# Altium project 英雄云台V1.施佳良.PrjPcb
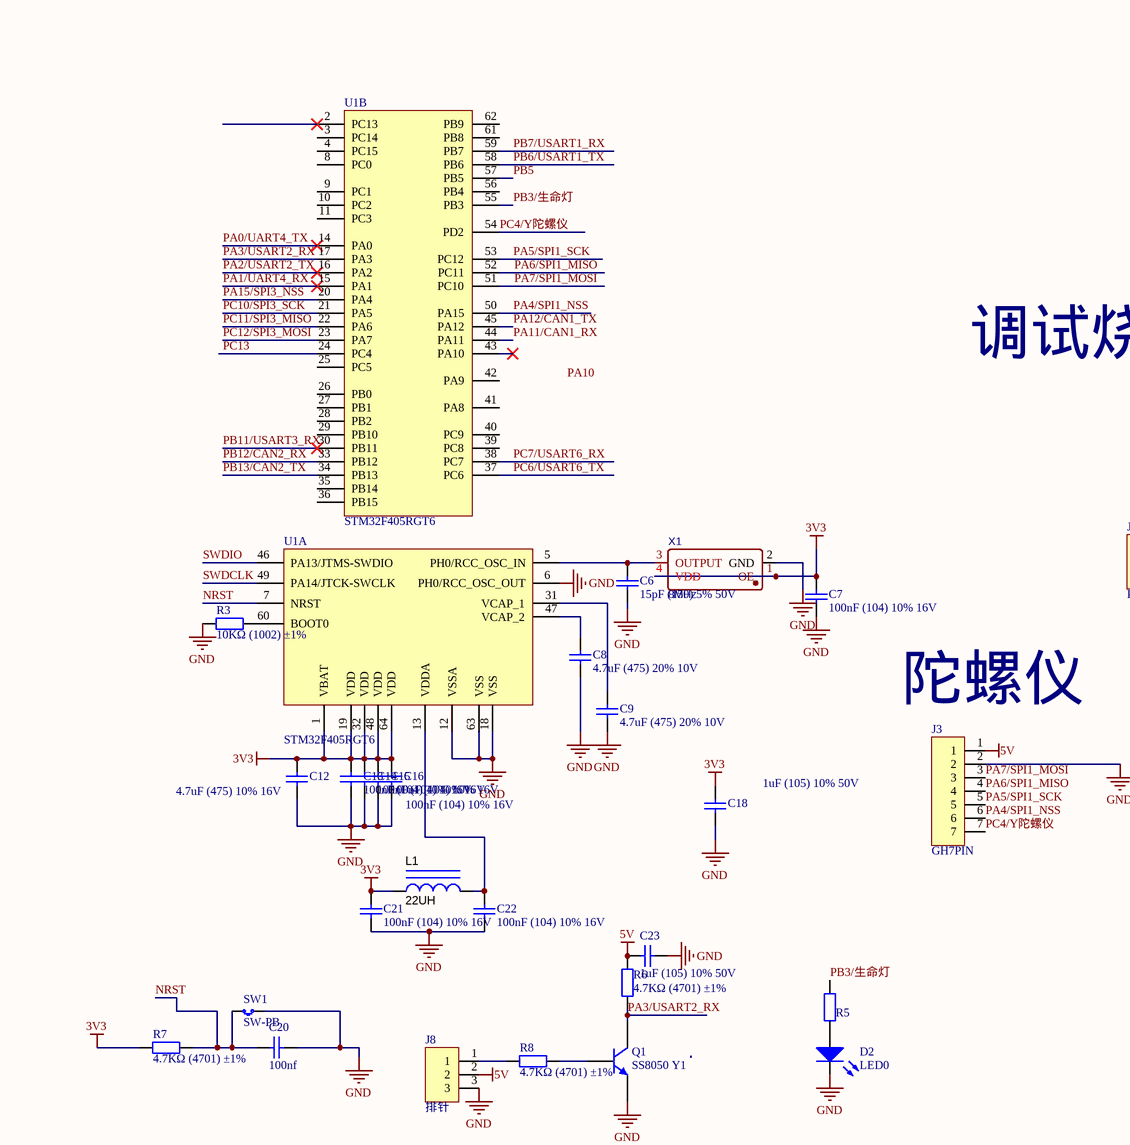
[diagram p0: 英雄云台V1.施佳良.SchDoc, top left]
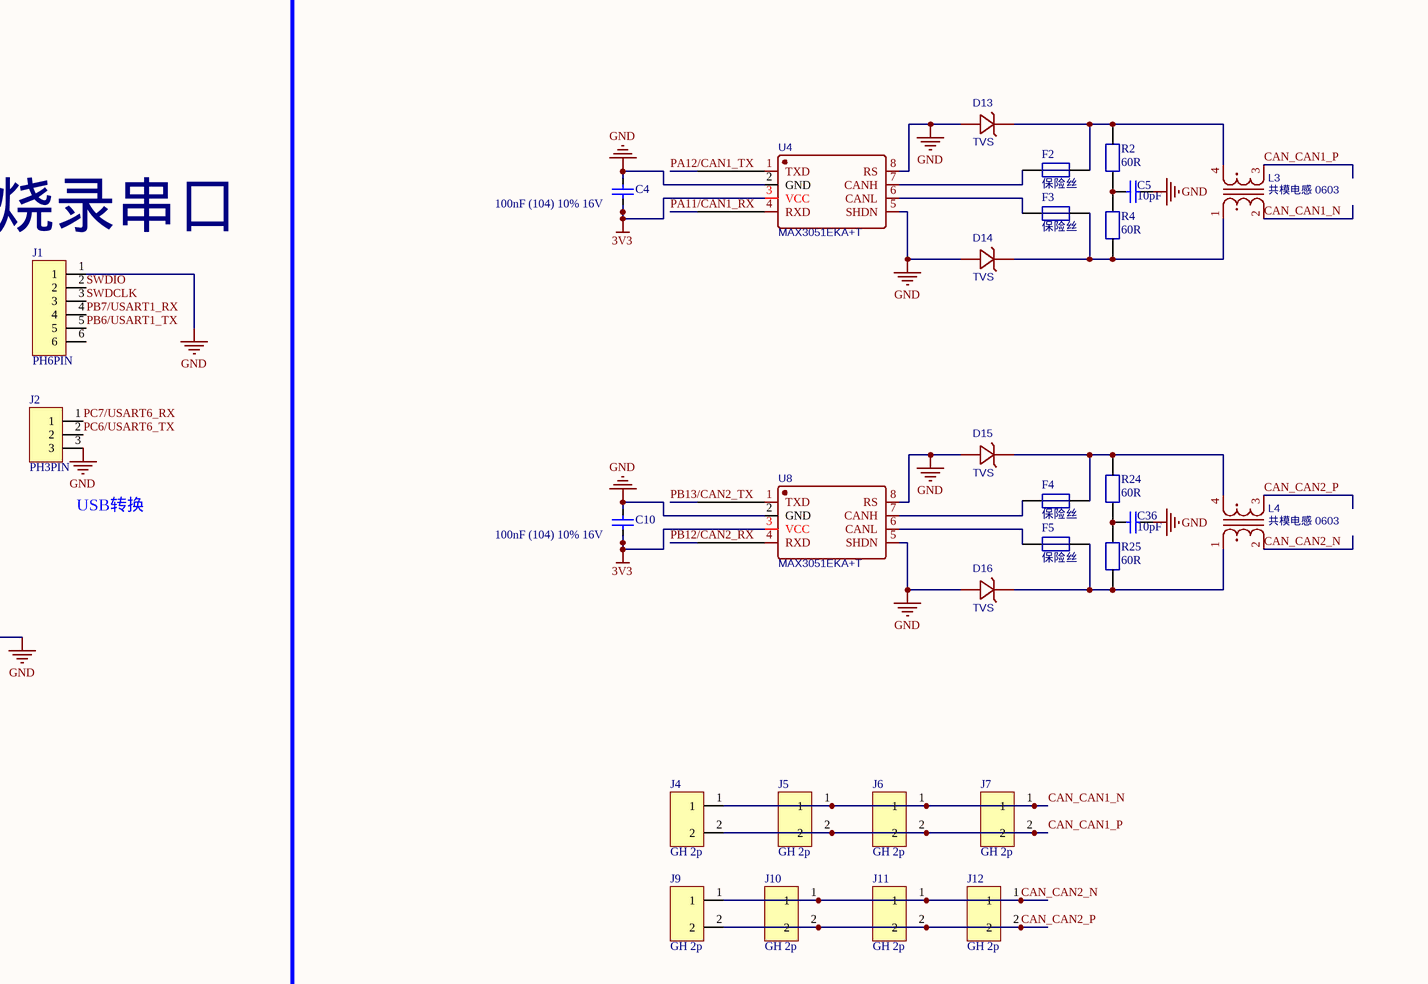
[diagram p1: 英雄云台V1.施佳良.SchDoc, top right]
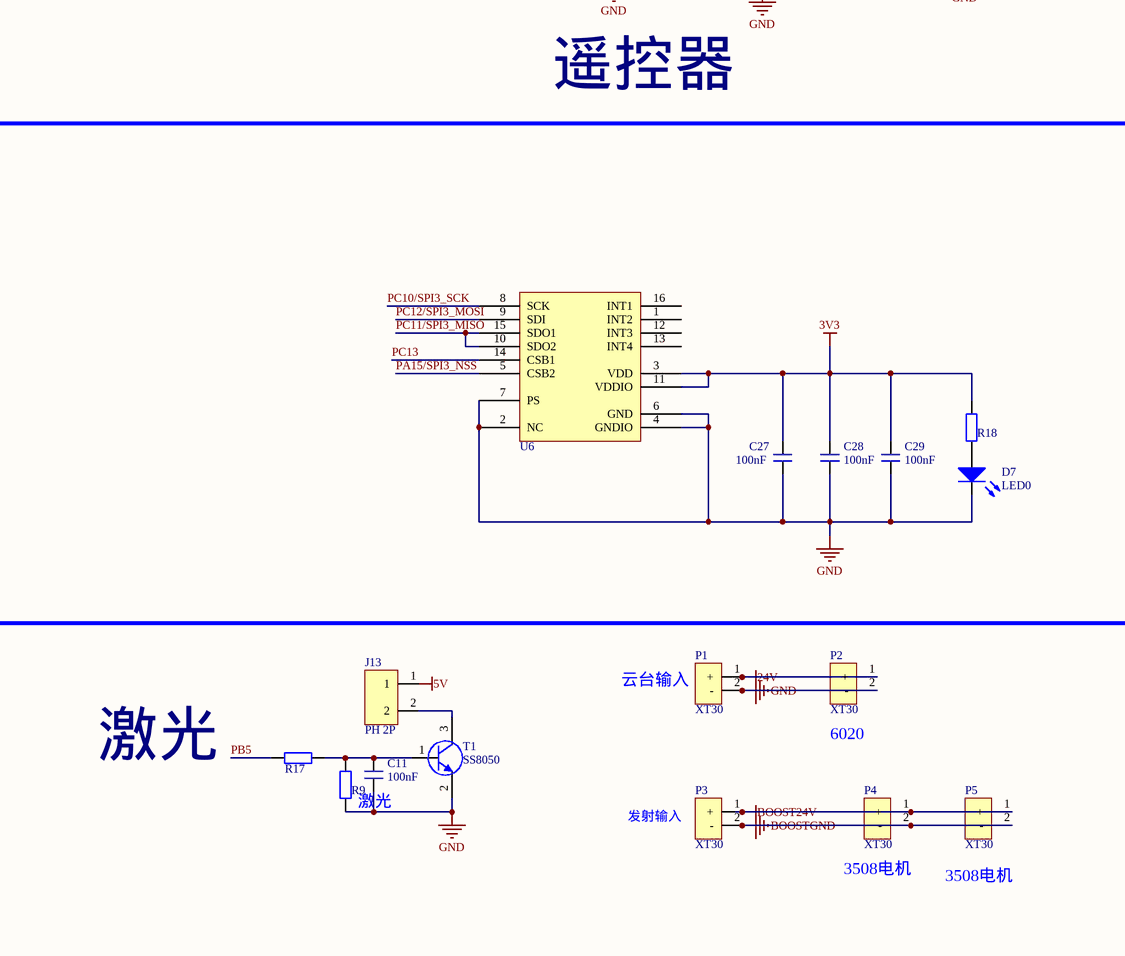
[diagram p2: 英雄云台V1.施佳良.SchDoc, bottom left]
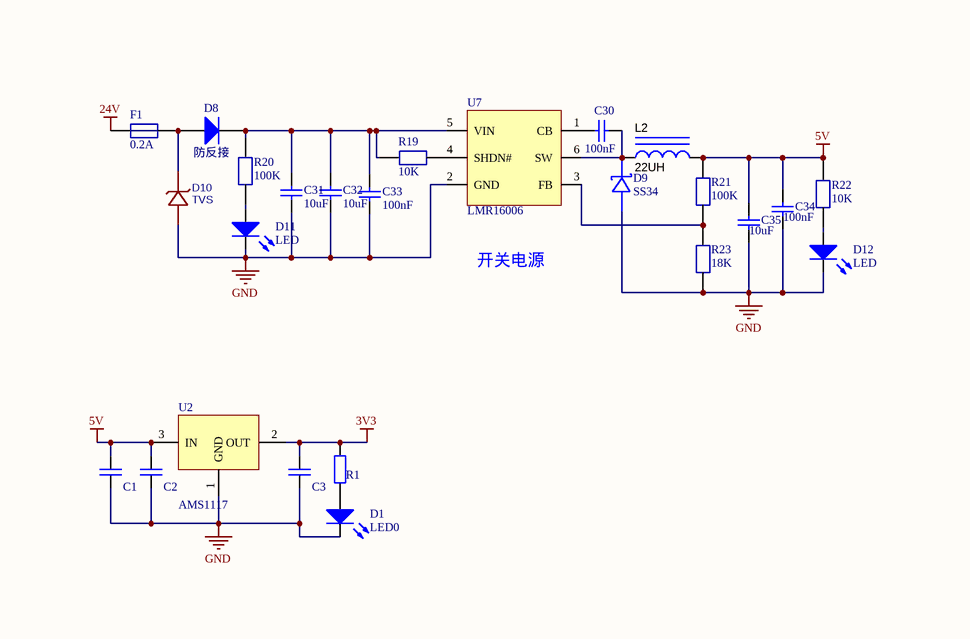
[diagram p3: 英雄云台V1.施佳良.SchDoc, bottom right]
1 sheet, 98 parts. Net scope: global (net labels, ports and power ports of the same name join across sheets).
Board file: 英雄云台V1.施佳良.PcbDoc

## Sheet 英雄云台V1.施佳良.SchDoc
size A2; SheetNumber: 1; SheetTotal: 1

### Parts
C1  ?uF  [1210_C]  (value not drawn)
C2  ?uF  [0603_C]  (value not drawn)
C3  ?uF  [1210_C]  (value not drawn)
C4  100nF (104) 10% 16V  [0603_C]
C5  10pF  [0603_C]
C6  15pF (150) 5% 50V  [0603_C]
C7  100nF (104) 10% 16V  [0603_C]
C8  4.7uF (475) 20% 10V  [0603_C]
C9  4.7uF (475) 20% 10V  [0603_C]
C10  100nF (104) 10% 16V  [0603_C]
C11  100nF  [0603_C]
C12  4.7uF (475) 10% 16V  [0603_C]
C13  100nF (104) 10% 16V  [0603_C]
C14  100nF (104) 10% 16V  [0603_C]
C15  100nF (104) 10% 16V  [0603_C]
C16  100nF (104) 10% 16V  [0603_C]
C18  1uF (105) 10% 50V  [0603_C]
C20  100nf  [0603_C]
C21  100nF (104) 10% 16V  [0603_C]
C22  100nF (104) 10% 16V  [0603_C]
C23  1uF (105) 10% 50V  [0603_C]
C27  100nF  [0603_C]
C28  100nF  [0603_C]
C29  100nF  [0603_C]
C30  100nF  [0603_C]
C31  10uF  [1210_C]
C32  10uF  [1210_C]
C33  100nF  [0603_C]
C34  100nF  [0603_C]
C35  10uF  [1210_C]
C36  10pF  [0603_C]
D1  LED0  [LED-0603]
D2  LED0  [LED-0603]
D7  LED0  [LED-0603]
D8  防反接  [二极管 SMAJ24A]
D9  SS34  [SOD-323]
D10  TVS  [TVS SOD-123FL_L2.8-W1.8-LS3.7-BI]
D11  LED  [LED-0603]
D12  LED  [LED-0603]
D13  TVS  [TVS SOD-323]
D14  TVS  [TVS SOD-323]
D15  TVS  [TVS SOD-323]
D16  TVS  [TVS SOD-323]
F1  0.2A  [保险丝 F1812]
F2  保险丝  [保险丝 F0603]
F3  保险丝  [保险丝 F0603]
F4  保险丝  [保险丝 F0603]
F5  保险丝  [保险丝 F0603]
J1  PH6PIN  [PH 6P(DIP)]
J2  PH3PIN  [PH 3P(DIP)]
J3  GH7PIN  [GH 7P 1.25mm 立 贴]
J4  GH 2p  [GH 2P 立]
J5  GH 2p  [GH 2P 立]
J6  GH 2p  [GH 2P 立]
J7  GH 2p  [GH 2P 立]
J8  排针  [SIP3]
J9  GH 2p  [GH 2P 立]
J10  GH 2p  [GH 2P 立]
J11  GH 2p  [GH 2P 立]
J12  GH 2p  [GH 2P 立]
J13  PH 2P  [PH 2P(DIP)]
L1  ValueDisplayed: 22UH  [0603_R]  (hidden comment: LPS4018-333MLB)
L2  ValueDisplayed: 22UH  [电感 (IND-SMD_L7.1-W6.6)]  (hidden comment: LPS4018-333MLB)
L3  共模电感 0603  [共模电感 IND-SMD_4P-L2.0-W1.2]
L4  共模电感 0603  [共模电感 IND-SMD_4P-L2.0-W1.2]
P1  XT30  [XT30PW公]
P2  XT30  [XT30 cewo]
P3  XT30  [XT30PW公]
P4  XT30  [真对线XT30]
P5  XT30  [真对线XT30]
Q1  SS8050 Y1  [SOT-23(SOT-23-3)]
R1  10k  [0603_R]  (value not drawn)
R2  60R  [0603_R]
R3  10KΩ (1002) ±1%  [0603_R]
R4  60R  [0603_R]
R5  10k  [0603_R]  (value not drawn)
R6  4.7KΩ (4701) ±1%  [0603_R]
R7  4.7KΩ (4701) ±1%  [0603_R]
R8  4.7KΩ (4701) ±1%  [0603_R]
R9  Res  [0603_R]  (value not drawn)
R17  Res  [0603_R]  (value not drawn)
R18  10k  [0603_R]  (value not drawn)
R19  10K  [0603_R]
R20  100K  [0603_R]
R21  100K  [0603_R]
R22  10K  [0603_R]
R23  18K  [0603_R]
R24  60R  [0603_R]
R25  60R  [0603_R]
SW1  SW-PB  [按键]
T1  SS8050  [SOT_23]
U1  STM32F405RGT6  [LC-LQFP-64_10x10x05P]  (parts A,B of 2)
U2  AMS1117  [SOT-223]
U4  MAX3051EKA+T  [SOIC-8_L4.9-W3.9-P1.27-LS6.0-BL]
U6  dmi088  [DMI088]  (value not drawn)
U7  LMR16006  [开关电源 (LMR16006)]
U8  MAX3051EKA+T  [SOIC-8_L4.9-W3.9-P1.27-LS6.0-BL]
X1  8MHz  [OSC-SMD_4P-L2.5-W2.0-BL]

### Nets
3V3: C3.2 C4.1 C7.2 C10.1 C12.2 C13.2 C14.2 C15.2 C16.2 C18.2 C21.2 C27.2 C28.2 C29.2 L1.1 R1.2 R7.1 R18.2 U1.1(VBAT) U1.19(VDD) U1.32(VDD) U1.48(VDD) U1.64(VDD) U2.2(OUT) U4.3(VCC) U6.3(VDD) U6.11(VDDIO) U8.3(VCC) X1.1(OE) X1.4(VDD)
5V: C1.2 C2.2 C23.1 C34.1 C35.1 J3.1 J8.2 J13.1 L2.2 R6.2 R21.1 R22.1 U2.3(IN)
24V: F1.1 P1.1(+) P2.1(+)
BOOST24V: P3.1(+) P4.1(+) P5.1(+)
BOOSTGND: P3.2(-) P4.2(-) P5.2(-)
GND: C1.1 C2.1 C3.1 C4.2 C5.2 C6.1 C7.1 C8.1 C9.1 C10.2 C11.1 C12.1 C13.1 C14.1 C15.1 C16.1 C18.1 C20.1 C21.1 C22.1 C23.2 C27.1 C28.1 C29.1 C31.2 C32.2 C33.2 C34.2 C35.2 C36.2 D1.2(K) D2.2(K) D7.2(K) D9.2(A) D10.2(A) D11.2(K) D12.2(K) D13.2(A) D14.2(A) D15.2(A) D16.2(A) J1.1 J2.3 J3.2 J8.3 P1.2(-) P2.2(-) Q1.2(E) R3.1 R9.1 R23.2 SW1.2 T1.2(E) U1.6(PH0/RCC_OSC_OUT) U1.12(VSSA) U1.18(VSS) U1.63(VSS) U2.1(GND) U4.2(GND) U4.5(SHDN) U4.8(RS) U6.2(NC) U6.4(GNDIO) U6.6(GND) U6.7(PS) U7.2(GND) U8.2(GND) U8.5(SHDN) U8.8(RS) X1.2(GND)
CAN_CAN1_N: J4.1 J5.1 J6.1 J7.1 L3.2
CAN_CAN1_P: J4.2 J5.2 J6.2 J7.2 L3.3
CAN_CAN2_N: J9.1 J10.1 J11.1 J12.1 L4.2
CAN_CAN2_P: J9.2 J10.2 J11.2 J12.2 L4.3
NRST: C20.2 R7.2 SW1.1 U1.7(NRST)
PA0/UART4_TX: U1.14(PA0)
PA1/UART4_RX: U1.15(PA1)
PA2/USART2_TX: U1.16(PA2)
PA3/USART2_RX: Q1.3(C) R6.1 U1.17(PA3)
PA4/SPI1_NSS: J3.6 U1.50(PA15)
PA5/SPI1_SCK: J3.5 U1.53(PC12)
PA6/SPI1_MISO: J3.4 U1.52(PC11)
PA7/SPI1_MOSI: J3.3 U1.51(PC10)
PA11/CAN1_RX: U1.44(PA11) U4.4(RXD)
PA12/CAN1_TX: U1.45(PA12) U4.1(TXD)
PA15/SPI3_NSS: U1.20(PA4) U6.5(CSB2)
PB3/生命灯: R5.2 U1.55(PB3)
PB5: R17.1 U1.57(PB5)
PB6/USART1_TX: J1.5 U1.58(PB6)
PB7/USART1_RX: J1.4 U1.59(PB7)
PB11/USART3_RX: U1.30(PB11)
PB12/CAN2_RX: U1.33(PB12) U8.4(RXD)
PB13/CAN2_TX: U1.34(PB13) U8.1(TXD)
PC4/Y陀螺仪: J3.7 U1.54(PD2)
PC6/USART6_TX: J2.2 U1.37(PC6)
PC7/USART6_RX: J2.1 U1.38(PC7)
PC10/SPI3_SCK: U1.21(PA5) U6.8(SCK)
PC11/SPI3_MISO: U1.22(PA6) U6.10(SDO2) U6.15(SDO1)
PC12/SPI3_MOSI: U1.23(PA7) U6.9(SDI)
PC13: U1.24(PC4) U6.14(CSB1)
SWDCLK: J1.3 U1.49(PA14/JTCK-SWCLK)
SWDIO: J1.2 U1.46(PA13/JTMS-SWDIO)
NetC5_1: C5.1 R2.1 R4.1
NetC6_2: C6.2 U1.5(PH0/RCC_OSC_IN) X1.3(OUTPUT)
NetC8_2: C8.2 U1.47(VCAP_2)
NetC9_2: C9.2 U1.31(VCAP_1)
NetC11_2: C11.2 R9.2 R17.2 T1.1(B)
NetC22_2: C22.2 L1.2 U1.13(VDDA)
NetC30_1: C30.1 U7.1(CB)
NetC30_2: C30.2 D9.1(K) L2.1 U7.6(SW)
NetC31_1: C31.1 C32.1 C33.1 D8.1(K) R19.1 R20.1 U7.5(VIN)
NetC36_1: C36.1 R24.1 R25.1
NetD1_1: D1.1(A) R1.1
NetD2_1: D2.1(A) R5.1
NetD7_1: D7.1(A) R18.1
NetD8_2: D8.2(A) D10.1(C) F1.2
NetD11_1: D11.1(A) R20.2
NetD12_1: D12.1(A) R22.2
NetD13_1: D13.1(C) F2.2 L3.4 R2.2
NetD14_1: D14.1(C) F3.2 L3.1 R4.2
NetD15_1: D15.1(C) F4.2 L4.4 R24.2
NetD16_1: D16.1(C) F5.2 L4.1 R25.2
NetF2_1: F2.1 U4.7(CANH)
NetF3_1: F3.1 U4.6(CANL)
NetF4_1: F4.1 U8.7(CANH)
NetF5_1: F5.1 U8.6(CANL)
NetJ8_1: J8.1 R8.1
NetJ13_2: J13.2 T1.3(C)
NetQ1_1: Q1.1(B) R8.2
NetR3_2: R3.2 U1.60(BOOT0)
NetR19_2: R19.2 U7.4(SHDN#)
NetR21_2: R21.2 R23.1 U7.3(FB)

Not connected (* = marked no-connect by the designer): J1 6; U1 2(PC13)* 3(PC14) 4(PC15) 8(PC0) 9(PC1) 10(PC2) 11(PC3) 25(PC5) 26(PB0) 27(PB1) 28(PB2) 29(PB10) 35(PB14) 36(PB15) 39(PC8) 40(PC9) 41(PA8) 42(PA9) 43(PA10)* 56(PB4) 61(PB8) 62(PB9); U6 1(INT2) 12(INT3) 13(INT4) 16(INT1)

### Notes on the sheet
- (near J1) 调试烧录串口
- (near J2) USB转换
- (near J3) 陀螺仪
- 遥控器
- 开关电源
- 云台输入
- 激光
- (near P2) 6020
- 发射输入
- (near P4) 3508电机
- (near P5) 3508电机
- Labels drawn without touching a wire or pin: PA10

### Library data of the parts
C1-C3 C11 C27-C29 = Cap: Published: 8-Jun-2000; LatestRevisionDate: 17-Jul-2002; LatestRevisionNote: Re-released for DXP Platform.; PackageReference: RAD-0.3; Publisher: Altium Limited
C4 C7 C10 C13-C16 C21 C22 = 0402 100nF (104) 10% 16V: 贴片电容; ComponentLink1Description: 供应商链接; ComponentLink1URL: http://www.szlcsc.com/product/details_1877.html; Package: 0402; Supplier: LC; SuppliersPartNumber: C1525
C5 C30-C36 = C: ComponentLink1Description: 供应商链接; ComponentLink1URL: http://www.szlcsc.com/product/details_20375.html; Package: 0603; Supplier: LC; SuppliersPartNumber: C19666
C6 = 0402 15pF (150) 5% 50V: 贴片电容; ComponentLink1Description: 供应商链接; ComponentLink1URL: http://www.szlcsc.com/product/details_1900.html; Package: 0402; Supplier: LC; SuppliersPartNumber: C1548
C8 C9 = 0402 4.7uF (475) 20% 10V: 贴片电容; ComponentLink1Description: 供应商链接; ComponentLink1URL: http://www.szlcsc.com/product/details_24469.html; Package: 0402; Supplier: LC; SuppliersPartNumber: C23733
C12 C20 = 0603 4.7uF (475) 10% 16V: 贴片电容; ComponentLink1Description: 供应商链接; ComponentLink1URL: http://www.szlcsc.com/product/details_20375.html; Package: 0603; Supplier: LC; SuppliersPartNumber: C19666
C18 C23 = 0603 1uF (105) 10% 50V: 贴片电容; ComponentLink1Description: 供应商链接; ComponentLink1URL: http://www.szlcsc.com/product/details_16531.html; Package: 0603; Supplier: LC; SuppliersPartNumber: C15849
D1 D2 D7 D11 D12 = LED0: 发光二极管; Published: 8-Jun-2000; LatestRevisionDate: 08-Jul-2005; LatestRevisionNote: Mech Layer 1 removed.; PackageReference: LED-0; Publisher: Altium Limited
D8 = 二极管
D10 D13-D16 = TVS: BOM_Manufacturer: MCC(Micro Commercial Components); BOM_Manufacturer Part: SMAJ36A-TP; Contributor: LCSC; BOM_Supplier: LCSC; BOM_Supplier Part: C669031; BOM_JLCPCB Part Class: Extended Part; spicePre: D; spiceSymbolName: SMAJ36A-TP
F1 = 保险丝
J1 = PH 6P
J2 J8 = PH 3P
J3 = GH 7PIN
L1 L2 = 电感: Inductor, Shielded Drum Core, Ferrite, 33 µH, 0.68 A, 0.42 ohm, SMD; Manufacturer: Coilcraft; Value: 33uH; Ind_H: 33.0E-6; Imax_A: 0.68; Irms: 0.8A @ 40C rise; Isat: 0.68A @ 30% inductance drop; DCR_ohm: 0.42; Value2: 0.68A; SizeAreaWB_mm2: 24.01; SizeArea_mm2: 15.21; SizeX_mm: 3.9; SizeZ_mm: 1.7; AEC Category: Q200; Green_Lifecycle: Not Set; Green_REACh: Incomplete; SymbolVersion: 2008-07-23; CompType: Inductor; PartNumber: LPS4018-333MLB; Value1: 0.42 ohm; Technology: Shielded Drum Core; MountType: SMT; Material: Ferrite; PackageReference: LPS4018; Published: 2008-06-26; Publisher: Texas Instruments; LatestRevisionDate: 2017-05-12; ComponentLink1Description: Datasheet link; ComponentLink1URL: http://www.coilcraft.com/pdfs/lps4018.pdf; RoHS: Y; SizeY_mm: 3.9; AEC Qualified: ?; Green_EU RoHS: Incomplete; Green_EU RoHS-2: Incomplete
L3 L4 = 共模电感 0603: BOM_Manufacturer: Prosperity Dielectrics; BOM_Manufacturer Part: SCM2012F-181M-I-LRH; nameAlias: Value; Contributor: LCSC; BOM_Supplier: LCSC; BOM_Supplier Part: C329447; spicePre: L; spiceSymbolName: SCM2012F-181M-I-LRH
Q1 = SOT-23 SS8050 Y1: 三极管; ComponentLink1Description: 供应商链接; ComponentLink1URL: http://www.szlcsc.com/product/details_2507.html; Package: SOT-23; Supplier: LC; SuppliersPartNumber: C2150
R1 R5 R18 = Res: Published: 8-Jun-2000; LatestRevisionDate: 17-Jul-2002; LatestRevisionNote: Re-released for DXP Platform.; PackageReference: AXIAL-0.4; Publisher: Altium Limited
R2 R4 R19-R25 = R
R3 = 0402 10KΩ (1002) 1%: 贴片电阻; ComponentLink1Description: 供应商链接; ComponentLink1URL: http://www.szlcsc.com/product/details_26487.html; Package: 0402; Supplier: LC; SuppliersPartNumber: C25744
R6-R8 = 0603 4.7KΩ (4701) 1%: 贴片电阻; ComponentLink1Description: 供应商链接; ComponentLink1URL: http://www.szlcsc.com/product/details_23889.html; Package: 0603; Supplier: LC; SuppliersPartNumber: C23162
T1 = SS8050: NPN; Published: 8-Jun-2000; LatestRevisionDate: 15-Jan-2003; LatestRevisionNote: PCB Footprint 'BCY-W3/D4.7' replaced; DatasheetDocument: 1997; PackageDocument: Sep-1998; PackageReference: TO-92A; Publisher: Altium Limited; Code_JEDEC: TO-92A; ComponentLink1Description: Manufacturer Link; ComponentLink1URL: http://www.fairchildsemi.com/; ComponentLink2Description: Datasheet; ComponentLink2URL: http://www.fairchildsemi.com/ds/2N%2F2N3904.pdf
U2 = AMS1117: 线性稳压3.3V-5V 1A
U4 U8 = MAX3051EKA+T: BOM_Manufacturer: MAXIM; BOM_Supplier: LCSC; BOM_Manufacturer Part: MAX3051EKA+T; BOM_Supplier Part: C112005; BOM_JLCPCB Part Class: Extended Part; spicePre: U; spiceSymbolName: MAX3051EKA+T
X1 = 8MHz: BOM_Manufacturer: Seiko Epson; BOM_Manufacturer Part: SG-8018CG-8.000000MHz-TJHSA; nameAlias: Frequency; Contributor: LCSC; BOM_Supplier: LCSC; BOM_Supplier Part: C390520; spicePre: X; spiceSymbolName: SG-8018CG-8.000000MHZ-TJHSA
R9 R17 = Res: Published: 8-Jun-2000; LatestRevisionDate: 17-Jul-2002; LatestRevisionNote: Re-released for DXP Platform.; PackageReference: AXIAL-0.4; Publisher: Altium Limited